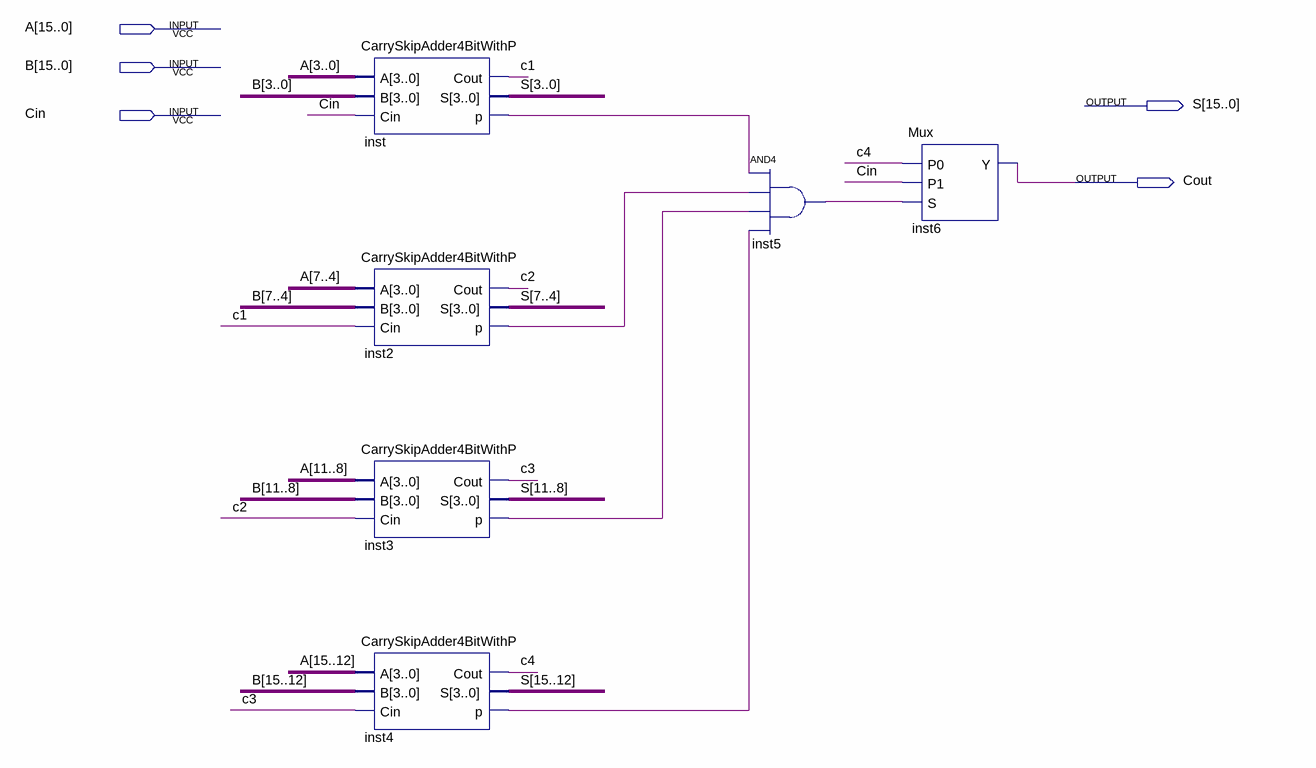
[diagram p0: schematic sheet]
// Quartus schematic CarrySkipAdder16Bit.bdf as structural Verilog: 6 symbols, 5 pins
module CarrySkipAdder16Bit (
  input  [15:0] A,
  input  [15:0] B,
  input  Cin,
  output [15:0] S,
  output Cout
);

  wire c1, c2, c3, c4, inst2_p, inst3_p, inst4_p, inst5_out, inst_p;

  CarrySkipAdder4BitWithP inst (.A(A[3:0]), .B(B[3:0]), .Cin(Cin), .Cout(c1), .S(S[3:0]), .p(inst_p));
  CarrySkipAdder4BitWithP inst2 (.A(A[7:4]), .B(B[7:4]), .Cin(c1), .Cout(c2), .S(S[7:4]), .p(inst2_p));
  CarrySkipAdder4BitWithP inst3 (.A(A[11:8]), .B(B[11:8]), .Cin(c2), .Cout(c3), .S(S[11:8]), .p(inst3_p));
  CarrySkipAdder4BitWithP inst4 (.A(A[15:12]), .B(B[15:12]), .Cin(c3), .Cout(c4), .S(S[15:12]), .p(inst4_p));
  and inst5 (inst5_out, inst_p, inst2_p, inst3_p, inst4_p);
  Mux inst6 (.P0(c4), .P1(Cin), .S(inst5_out), .Y(Cout));
endmodule
